# EAGLE design dualpower (EAGLE 9.6.2)
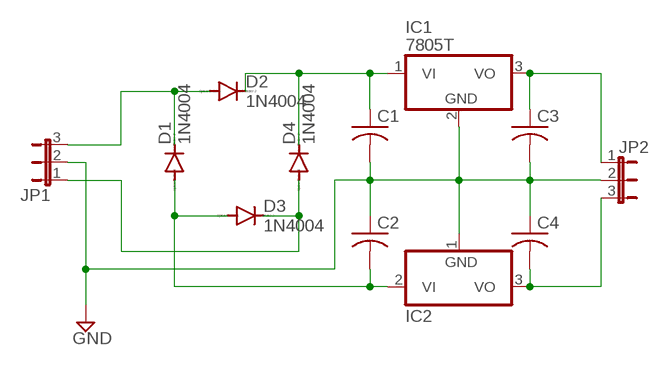
[diagram p0: schematic, sheet 1]

## Parts
C1  C-US025-024X044  [C025-024X044]
C2  C-US025-024X044  [C025-024X044]
C3  C-US025-024X044  [C025-024X044]
C4  C-US025-024X044  [C025-024X044]
D1  1N4004  [DO41-10]
D2  1N4004  [DO41-10]
D3  1N4004  [DO41-10]
D4  1N4004  [DO41-10]
IC1  7805T  [TO220H]
IC2  79L05Z  [TO92]
JP1  JP2W  [JP2W]
JP2  JP2W  [JP2W]

## Nets
GND: C1.2 C2.1 C3.2 C4.1 IC1.2(GND) IC2.1(GND) JP1.2 JP2.2
N$1: D1.C D2.A JP1.3
N$2: C2.2 D1.A D3.A IC2.2(VI)
N$3: D3.C D4.A JP1.1
N$4: C1.1 D2.C D4.C IC1.1(VI)
N$8: C3.1 IC1.3(VO) JP2.1
N$9: C4.2 IC2.3(VO) JP2.3

## Library data of the parts
C1-C4 = rcl:C-US: CAPACITOR, American symbol; SPICEPREFIX: C
D1-D4 = diode:1N4004: DIODE general purpose rectifier, 1 A
IC1 = linear:78*: Positive VOLTAGE REGULATOR Source: http://cache.national.com/ds/LM/LM78L05.pdf http://www.fairchildsemi.com/ds/LM/LM7805.pdf
IC2 = linear:79*: Negative VOLTAGE REGULATOR
JP1 JP2 = jumper:JP2W: JUMPER

## Board
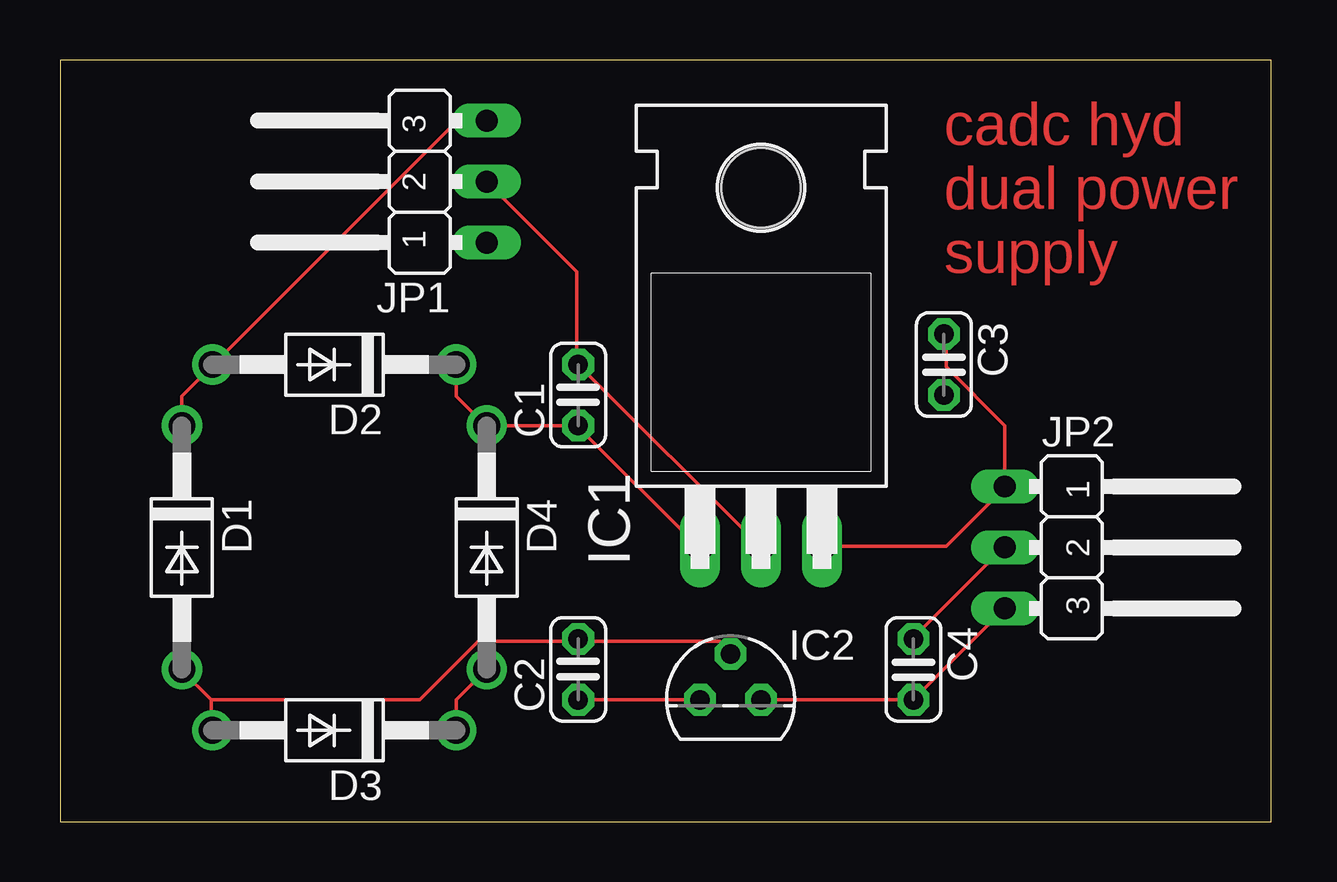
[diagram p1: board, top side]
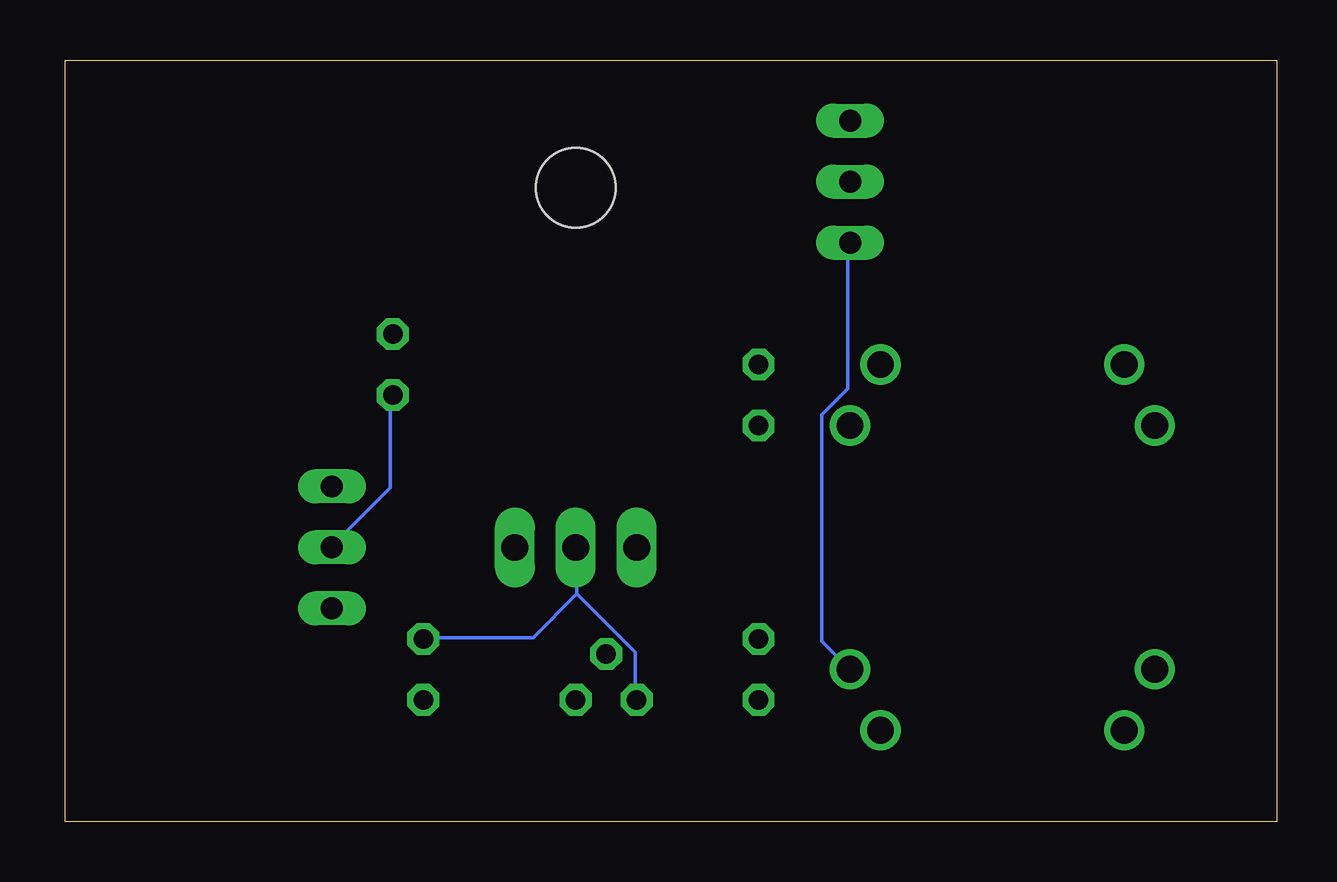
[diagram p2: board, bottom side, seen from below]

Size 50.47 x 31.74 mm. Coordinates in mm from the lower left corner, seen from the top.
Outline: 0,0 50.47,0 50.47,31.74 0,31.74 0,0
Copper layers (1*16): Top 0.035mm / dielectric 1.5mm / Bottom 0.035mm
Design rules "default": minimum track width 6mil, minimum drill 0.35mm, track to track 6mil, track to pad 6mil, pad to pad 6mil, via to via 6mil, smd to smd 6mil, copper to edge 40mil, drill to drill 6mil, minimum pad ring 10mil, minimum via ring 8mil, stop-mask expansion 4mil, vias tented up to drill 0mil, thermal gap 10mil

### Footprints (pad centres in the part's own frame; a part is rotated, then mirrored left to right if it is on the bottom)
C025-024X044 = drill 0.813 octagon: 1 -1.27,0; 2 1.27,0
DO41-10 = drill 1.118: A 5.08,0; C -5.08,0
TO220H = drill 1.118 long: 1 -2.54,-10.16; 2 0,-10.16; 3 2.54,-10.16 | hole 3.302: 0,4.826
TO92 = drill 0.813 octagon: 1 -1.27,0; 2 0,1.905; 3 1.27,0
JP2W = drill 0.914 long: 1 -2.54,-1.27; 2 0,-1.27; 3 2.54,-1.27

### Placement (x,y rotation side)
C1  21.59,17.78 90 top
C2  21.59,6.35 90 top
C3  36.83,19.05 270 top
C4  35.56,6.35 270 top
D1  5.08,11.43 270 top
D2  11.43,19.05 180 top
D3  11.43,3.81 180 top
D4  17.78,11.43 270 top
IC1  29.21,21.59 0 top
IC2  27.94,5.08 0 top
JP1  16.51,26.67 90 top
JP2  40.64,11.43 270 top

### Tracks (layer width: path | path; a pad name or v marks a point on that pad's centre or on a via)
GND
  Top 0.152: C4.1 35.56,7.67 39.37,11.48 JP2.2 | JP1.2 21.54,22.91 21.54,19.1 C1.2 IC1.2 | IC2.1 C2.1
  Bottom 0.152: C3.2 36.93,17.73 36.93,13.92 39.37,11.48 JP2.2 | 29.16,9.5 29.16,11.33 IC1.2 | 29.16,9.5 26.72,7.06 26.72,5.08 IC2.1 | 29.16,9.5 30.99,7.67 35.56,7.67 C4.1
N$1
  Top 0.152: JP1.3 17.73,29.16 16.51,29.16 6.45,19.1 D2.A 6.3,18.95 5.08,17.73 D1.C
N$2
  Top 0.152: 6.3,5.08 6.3,3.86 D3.A | 6.3,5.08 5.08,6.3 D1.A | IC2.2 27.94,7.06 27.48,7.52 21.69,7.52 C2.2 21.54,7.52 17.42,7.52 14.99,5.08 6.3,5.08
N$3
  Top 0.152: D3.C 16.51,5.08 D4.A
  Bottom 0.152: D4.A 18.95,7.52 18.95,16.97 17.88,18.03 17.88,24.13 JP1.1
N$4
  Top 0.152: 21.54,16.51 D4.C 17.73,16.51 16.51,17.73 D2.C | 21.54,16.51 26.57,11.48 IC1.1 | 21.54,16.51 C1.1
N$8
  Top 0.152: C3.1 36.93,20.32 36.93,18.95 39.37,16.51 JP2.1 39.37,13.92 36.93,11.48 31.75,11.48 IC1.3
N$9
  Top 0.152: IC2.3 C4.2 JP2.3

### Text on the board
Top: cadc hyd / dual power / supply